# EAGLE design PowerBricksBoard1_X14 (EAGLE 9.6.2)
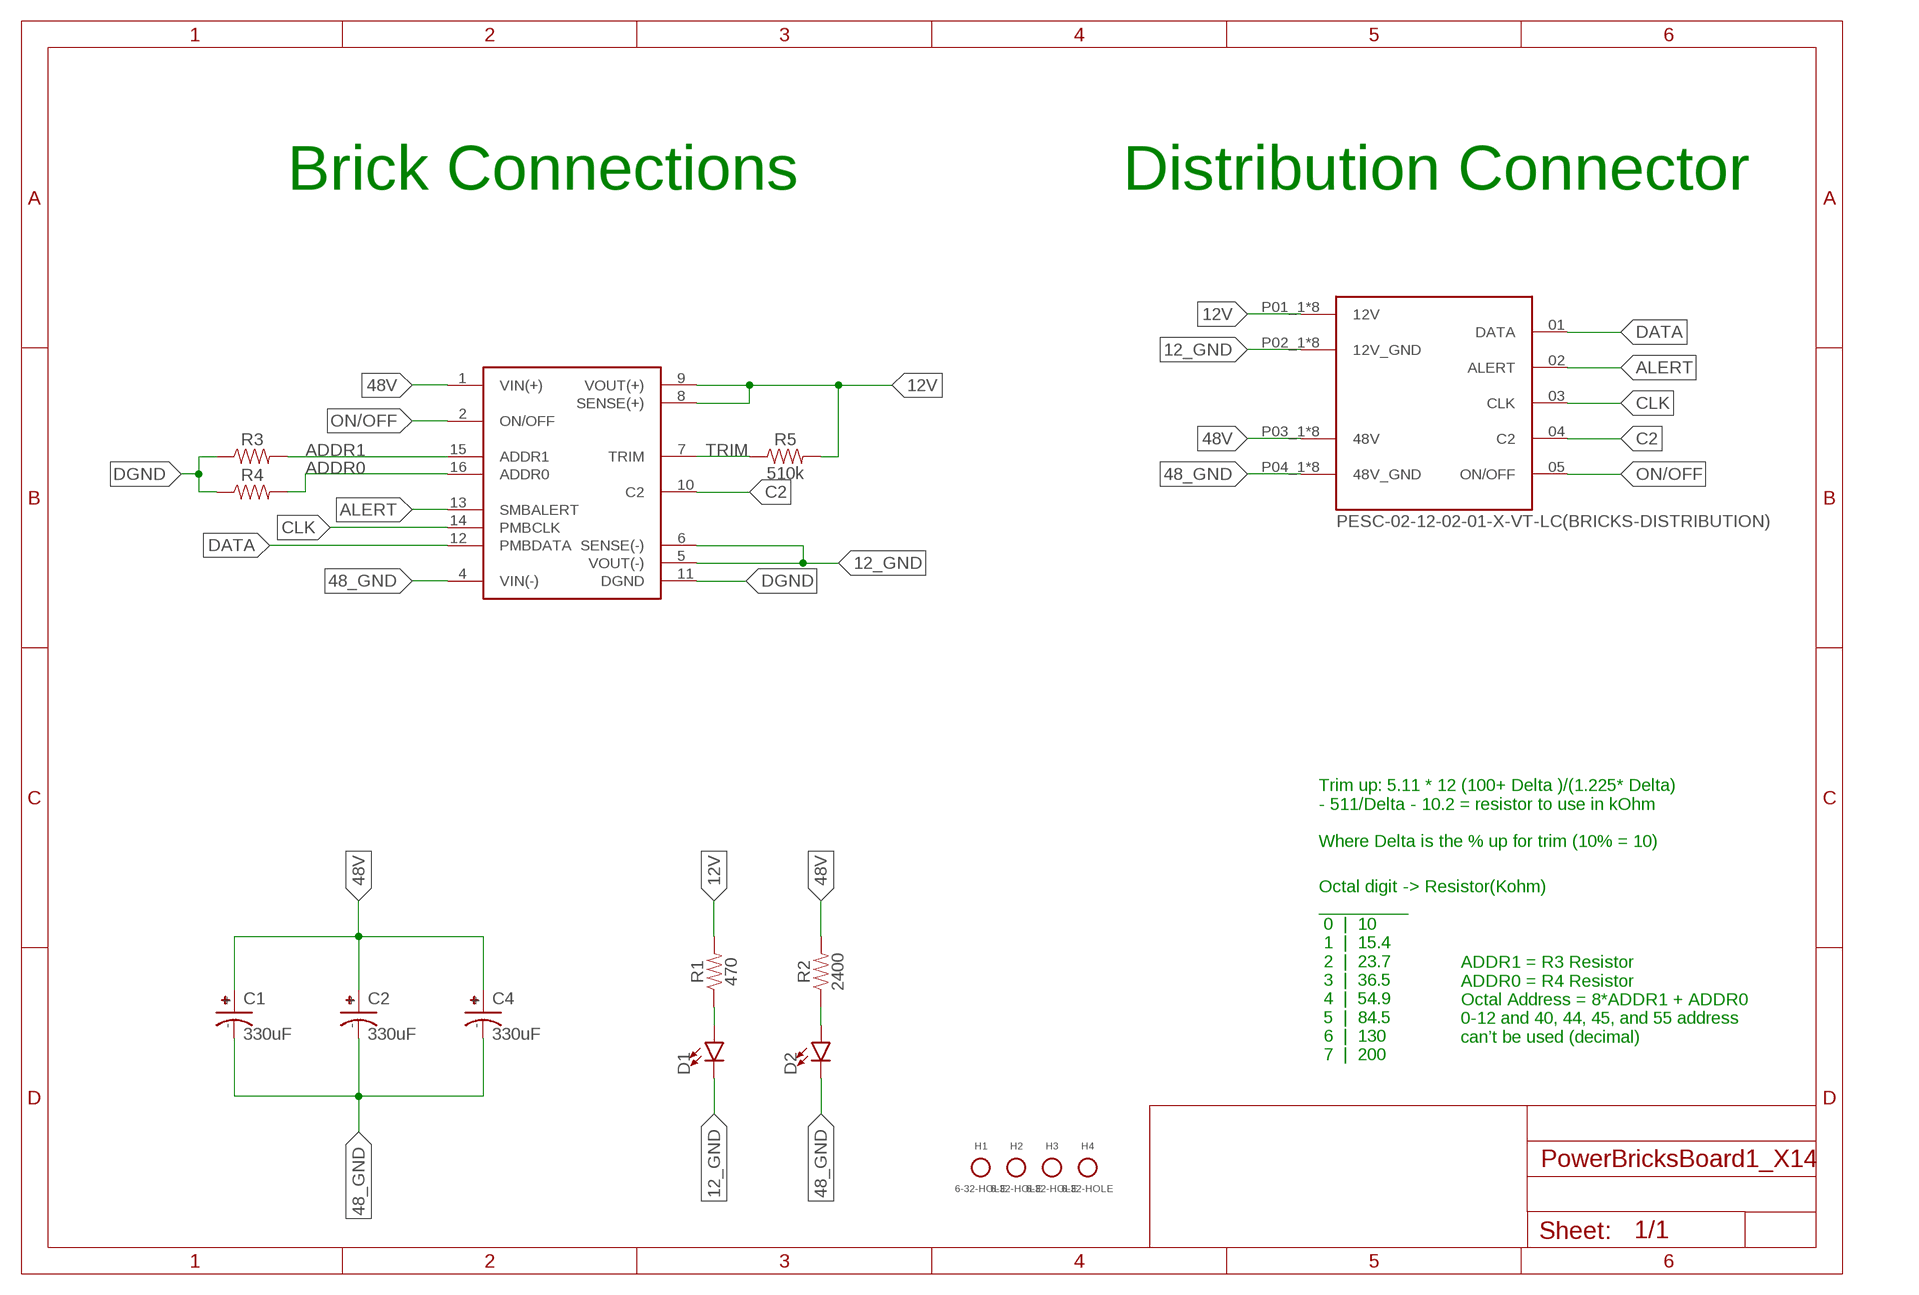
[diagram p0: schematic, sheet 1]

## Parts
C1  330uF  UCM1H331MNL1GS  [CAPAE1030X1050N]
C2  330uF  UCM1H331MNL1GS  [CAPAE1030X1050N]
C4  330uF  UCM1H331MNL1GS  [CAPAE1030X1050N]
D1  LED0603  [LED-0603]
D2  LED0603  [LED-0603]
H1  6-32-HOLE  [6-32-HOLE]
H2  6-32-HOLE  [6-32-HOLE]
H3  6-32-HOLE  [6-32-HOLE]
H4  6-32-HOLE  [6-32-HOLE]
J1  PESC-02-12-02-01-X-VT-LC(BRICKS-DISTRIBUTION)  [SAMTEC_PESC-02-12-02-01-X-VT-LC(B-D)]
R1  470  RESISTOR0603  [0603]
R2  2400  RESISTOR0603  [0603]
R3  RESISTOR0603  [0603]
R4  RESISTOR0603  [0603]
R5  510k  RESISTOR0603  [0603]
U$2  Q48SC12050NRDH  [Q48SC12050NRDH]

## Nets
12_GND: D1.C J1.P02_1(12V_GND) J1.P02_2(12V_GND) J1.P02_3(12V_GND) J1.P02_4(12V_GND) J1.P02_5(12V_GND) J1.P02_6(12V_GND) J1.P02_7(12V_GND) J1.P02_8(12V_GND) U$2.5(VOUT(-)) U$2.6(SENSE(-))
12V: J1.P01_1(12V) J1.P01_2(12V) J1.P01_3(12V) J1.P01_4(12V) J1.P01_5(12V) J1.P01_6(12V) J1.P01_7(12V) J1.P01_8(12V) R1.2 R5.2 U$2.8(SENSE(+)) U$2.9(VOUT(+))
48_GND: C1.- C2.- C4.- D2.C J1.P04_1(48V_GND) J1.P04_2(48V_GND) J1.P04_3(48V_GND) J1.P04_4(48V_GND) J1.P04_5(48V_GND) J1.P04_6(48V_GND) J1.P04_7(48V_GND) J1.P04_8(48V_GND) U$2.4(VIN(-))
48V: C1.+ C2.+ C4.+ J1.P03_1(48V) J1.P03_2(48V) J1.P03_3(48V) J1.P03_4(48V) J1.P03_5(48V) J1.P03_6(48V) J1.P03_7(48V) J1.P03_8(48V) R2.2 U$2.1(VIN(+))
ADDR0: R4.2 U$2.16(ADDR0)
ADDR1: R3.2 U$2.15(ADDR1)
ALERT: J1.02(ALERT) U$2.13(SMBALERT)
C2: J1.04(C2) U$2.10(C2)
CLK: J1.03(CLK) U$2.14(PMBCLK)
DATA: J1.01(DATA) U$2.12(PMBDATA)
DGND: R3.1 R4.1 U$2.11(DGND)
N$1: D1.A R1.1
N$2: D2.A R2.1
ON/OFF: J1.05(ON/OFF) U$2.2(ON/OFF)
TRIM: R5.1 U$2.7(TRIM)

## Notes on the sheet
- Brick Connections | Distribution Connector
- Trim up: 5.11 * 12 (100+ Delta )/(1.225* Delta) 
  - 511/Delta - 10.2 = resistor to use in kOhm
  
  Where Delta is the % up for trim (10% = 10)
- ADDR1 = R3 Resistor
  ADDR0 = R4 Resistor
  Octal Address = 8*ADDR1 + ADDR0 
  0-12 and 40, 44, 45, and 55 address 
  can’t be used (decimal)
- Octal digit -> Resistor(Kohm) 
  _________
   0  |  10 
   1  |  15.4 
   2  |  23.7 
   3  |  36.5 
   4  |  54.9 
   5  |  84.5 
   6  |  130 
   7  |  200

## Library data of the parts
C1 C2 C4 = brick-capacitor-UCM1H331MNL1GS:UCM1H331MNL1GS: Nichicon 330uF 50 V Aluminium Electrolytic Capacitor SMD, CM Series 2000h 10 (Dia.) x 10mm Source: Datasheet <http://www.nichicon.co.jp/english/products/pdfs/e-ucm.pdf>; ARROW_PART_NUMBER: UCM1H331MNL1GS; ARROW_PRICE-STOCK: https://www.arrow.com/en/products/ucm1h331mnl1gs/nichicon; DESCRIPTION: Nichicon 330uF 50 V Aluminium Electrolytic Capacitor SMD, CM Series 2000h 10 (Dia.) x 10mm; HEIGHT: 10.5mm; MANUFACTURER_NAME: Nichicon; MANUFACTURER_PART_NUMBER: UCM1H331MNL1GS; MOUSER_PART_NUMBER: 647-UCM1H331MNL1GS; MOUSER_PRICE-STOCK: https://www.mouser.co.uk/ProductDetail/Nichicon/UCM1H331MNL1GS?qs=DSgADHjnLTkTovFLdbC%252BNg%3D%3D
D1 D2 = SparkFun-LED:LED: LED (Generic) Standard schematic elements and footprints for 5mm, 3mm, 1206, and 0603 sized LEDs. Generic LEDs with no color specified.
H1-H4 = Mounting Holes:6-32-HOLE
J1 = CONN, Distribution-Bricks:PESC-02-12-02-01-X-VT-LC(BRICKS-DISTRIBUTION): 16 (12 + 4 Power) Position Receptacle Connector Through Hole Gold; MANUFACTURER: Samtec; MAXIMUM_PACKAGE_HEIGHT: 17.04mm; PARTREV: B; STANDARD: Manufacturer Recommendations
R1-R5 = SparkFun-Resistors:RESISTOR: Generic Resistor Package
U$2 = Delta Power Bricks - Q48SC12050NRDH:Q48SC12050NRDH

## Board
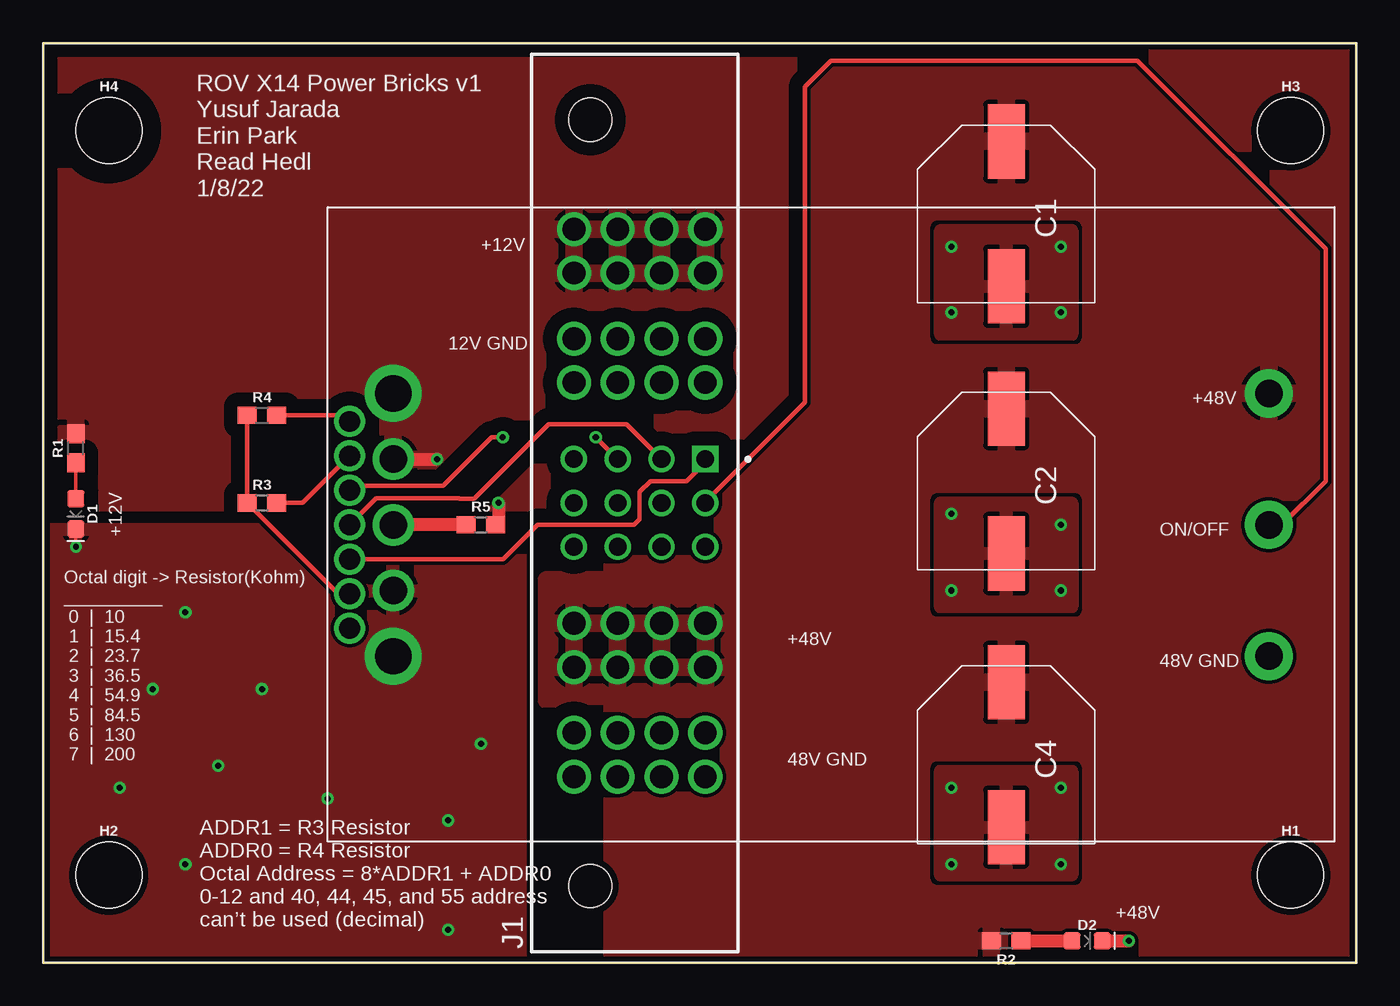
[diagram p1: board, top side]
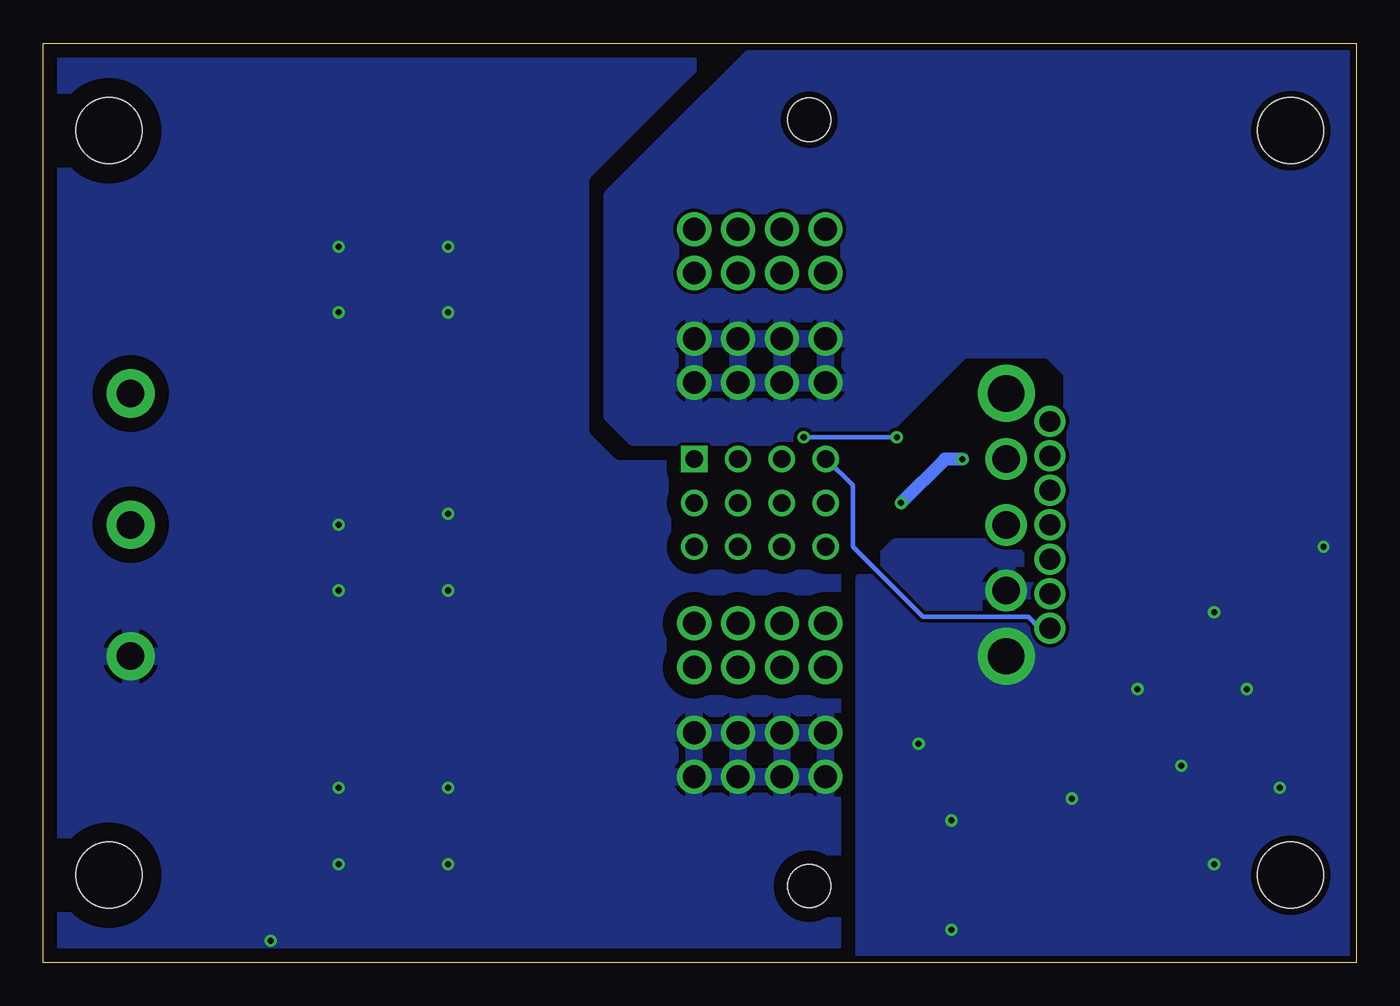
[diagram p2: board, bottom side, seen from below]

Size 76.2 x 53.34 mm. Coordinates in mm from the lower left corner, seen from the top.
Outline: 0,0 76.2,0 76.2,53.34 0,53.34 0,0
Copper layers (1*16): Top 0.0356mm / dielectric 1.5011mm / Bottom 0.0356mm
Design rules "ECE_Senior_Design": minimum track width 8mil, minimum drill 13mil, track to track 8mil, track to pad 8mil, pad to pad 6mil, via to via 8mil, smd to smd 6mil, copper to edge 15mil, drill to drill 8mil, minimum pad ring 7mil, minimum via ring 7mil, stop-mask expansion 3mil, vias tented up to drill 0mil, thermal gap 10mil

### Footprints (pad centres in the part's own frame; a part is rotated, then mirrored left to right if it is on the bottom)
CAPAE1030X1050N = smd 4.3 x 2.15: + -4.2,0; - 4.2,0
LED-0603 = smd 1 x 1: A -0.877,0; C 0.877,0
6-32-HOLE = hole 3.81: 0,0
SAMTEC_PESC-02-12-02-01-X-VT-LC(B-D) = drill 1.02 square: 01 2.54,-1.59 | drill 1.02: 02 2.54,0.95; 03 2.54,3.49; 04 2.54,6.03; 05 0,-1.59; 06 0,0.95; 07 0,3.49; 08 0,6.03; 09 -2.54,-1.59; 10 -2.54,0.95; 11 -2.54,3.49; 12 -2.54,6.03 | drill 1.32: P01_1 15.875,-1.59; P01_2 15.875,0.95; P01_3 15.875,3.49; P01_4 15.875,6.03; P01_5 13.335,-1.59; P01_6 13.335,0.95; P01_7 13.335,3.49; P01_8 13.335,6.03; P02_1 9.525,-1.59; P02_2 9.525,0.95; P02_3 9.525,3.49; P02_4 9.525,6.03; P02_5 6.985,-1.59; P02_6 6.985,0.95; P02_7 6.985,3.49; P02_8 6.985,6.03; P03_1 -6.985,-1.59; P03_2 -6.985,0.95; P03_3 -6.985,3.49; P03_4 -6.985,6.03; P03_5 -9.525,-1.59; P03_6 -9.525,0.95; P03_7 -9.525,3.49; P03_8 -9.525,6.03; P04_1 -13.335,-1.59; P04_2 -13.335,0.95; P04_3 -13.335,3.49; P04_4 -13.335,6.03; P04_5 -15.875,-1.59; P04_6 -15.875,0.95; P04_7 -15.875,3.49; P04_8 -15.875,6.03 | hole 2.49: -22.225,5.08; 22.225,5.08
0603 = smd 1.1 x 1: 1 -0.85,0; 2 0.85,0
Q48SC12050NRDH = drill 1.6 pad 2.794: 1 0,0; 2 0,7.62; 4 0,15.24 | drill 2.1 pad 3.302: 5 50.8,15.24; 9 50.8,0 | drill 1.6: 6 50.8,11.43; 7 50.8,7.62; 8 50.8,3.81 | drill 1.2: 10 53.34,13.62; 11 53.34,11.62; 12 53.34,9.62; 13 53.34,7.62; 14 53.34,5.62; 15 53.34,3.62; 16 53.34,1.62

### Placement (x,y rotation side)
C1  55.88,43.43 270 top
C2  55.88,27.94 270 top
C4  55.88,12.06 270 top
D1  1.91,26.04 270 top
D2  60.58,1.27 0 top
H1  72.39,5.08 0 top
H2  3.81,5.08 0 top
H3  72.39,48.26 0 top
H4  3.81,48.26 0 top
J1  36.83,26.67 90 top
R1  1.91,29.84 90 top
R2  55.88,1.27 180 top
R3  12.7,26.67 0 top
R4  12.7,31.75 0 top
R5  25.4,25.4 0 top
U$2  71.12,33.02 180 top

### Tracks (layer width: path | path; a pad name or v marks a point on that pad's centre or on a via)
12_GND  (via drill 0.33, 0.35)
  Top 0.203: D1.C v1.91,24.13
  other vias: 8.26,20.32 6.35,15.88 12.7,15.88 10.16,11.43 4.45,10.16 8.26,5.71 16.51,9.53 23.5,1.91 23.5,8.26 25.4,12.7
  pour Bottom: -1.27,55.88 31.75,55.88 43.18,44.45 43.18,31.75 41.91,30.48 27.94,30.48 22.86,35.56 17.78,35.56 16.51,34.29 16.51,19.05 17.78,17.78 19.05,19.05 19.05,22.86 20.32,24.13 26.67,24.13 28.57,22.22 28.57,-2.54 -1.27,-2.54
  pour Top: -0.51,0 -0.51,25.15 27.69,25.15 27.69,0
12V  (via drill 0.35)
  Top 0.762: U$2.8 v22.86,29.21 | v26.42,26.67 26.42,25.57 R5.2
  Bottom 0.762: v22.86,29.21 23.88,29.21 v26.42,26.67
  pour Top (isolate 0.813): 0,52.07 43.81,52.07 43.81,26.67 0,26.67
48_GND  (via drill 0.35)
  Top 0.762: D2.C v62.99,1.27
  other vias: 52.7,10.16 59.05,10.16 52.7,21.59 59.05,21.59 59.05,25.4 52.7,26.04 52.7,37.72 52.7,41.53 59.05,41.53 59.05,37.72 52.7,5.71 59.05,5.71
  pour Bottom (isolate 0.813, rank 6): 27.18,56.9 27.18,-3.3 79.5,-3.3 79.5,56.9
  pour Top: 52.07,11.11 59.69,11.11 59.69,5.08 52.07,5.08
  pour Top: 52.07,42.48 59.69,42.48 59.69,36.45 52.07,36.45
  pour Top: 52.07,26.67 59.69,26.67 59.69,20.64 52.07,20.64
48V
  pour Top (isolate 0.813): 41.91,22.22 29.21,22.22 29.21,15.24 41.91,15.24
  pour Top (rank 4): 40.64,62.23 33.02,54.61 33.02,-5.08 35.56,-7.62 69.85,-7.62 85.09,7.62 85.09,55.88 78.74,62.23
ADDR0
  Top 0.254: R4.2 17.43,31.75 U$2.16
ADDR1
  Top 0.254: U$2.15 15.05,26.67 R3.2
ALERT
  Top 0.254: U$2.13 19.31,26.93 24.12,26.93 24.13,26.92 25.02,26.92 29.34,31.24 33.85,31.24 J1.02
C2
  Bottom 0.254: U$2.10 18.38,19.4 19.04,20.06 20.95,20.06 20.96,20.07 25.15,20.07 29.21,24.13 29.21,27.69 30.73,29.21 J1.04
CLK  (via drill 0.35)
  Top 0.254: U$2.14 18.03,27.65 23.21,27.65 26.04,30.48 v26.67,30.48 | v32.07,30.48 32.7,29.85 J1.03
  Bottom 0.254: v26.67,30.48 v32.07,30.48
DATA
  Top 0.254: U$2.12 26.7,23.4 28.7,25.4 34.29,25.4 34.61,25.72 34.61,27.3 35.24,27.94 37.34,27.94 38.42,29.02 J1.01
DGND
  Top 0.254: U$2.11 17.12,21.4 R3.1 R4.1
N$1
  Top 0.203: R1.1 D1.A
N$2
  Top 0.762: R2.1 D2.A
ON/OFF
  Top 0.254: J1.05 38.42,26.74 44.2,32.51 44.2,50.8 45.72,52.32 63.5,52.32 74.42,41.4 74.42,27.94 71.88,25.4 U$2.2
TRIM
  Top 0.762: R5.1 U$2.7

### Text on the board
tNames: ROV X14 Power Bricks v1 / Yusuf Jarada / Erin Park / Read Hedl / 1/8/22 | +12V | 12V GND | +48V | +12V | ON/OFF | +48V | 48V GND | Octal digit -> Resistor(Kohm) / _________ / 0 | 10 / 1 | 15.4 / 2 | 23.7 / 3 | 36.5 / 4 | 54.9 / 5 | 84.5 / 6 | 130 / 7 | 200 | 48V GND | ADDR1 = R3 Resistor / ADDR0 = R4 Resistor / Octal Address = 8*ADDR1 + ADDR0 / 0-12 and 40, 44, 45, and 55 address / can’t be used (decimal) | +48V